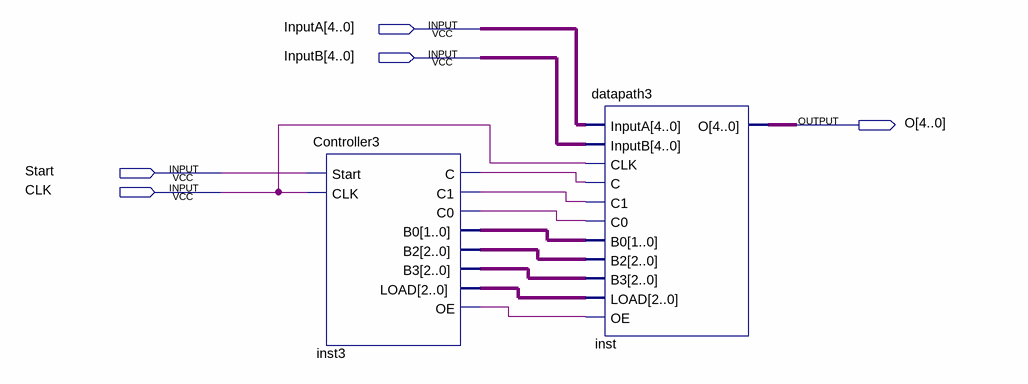
[diagram p0: schematic sheet]
// Quartus schematic BS.bdf as structural Verilog: 2 symbols, 5 pins
module BS (
  input  [4:0] InputA,
  input  [4:0] InputB,
  input  Start,
  input  CLK,
  output [4:0] O
);

  wire inst3_c, inst3_c0, inst3_c1, inst3_oe;
  wire [1:0] inst3_b0;
  wire [2:0] inst3_b2, inst3_b3, inst3_load;

  Controller3 inst3 (
    .Start(Start), .CLK(CLK), .C(inst3_c), .C1(inst3_c1), .C0(inst3_c0), .B0(inst3_b0), .B2(inst3_b2),
    .B3(inst3_b3), .LOAD(inst3_load), .OE(inst3_oe));
  datapath3 inst (
    .InputA(InputA), .InputB(InputB), .CLK(CLK), .C(inst3_c), .C1(inst3_c1), .C0(inst3_c0), .B0(inst3_b0),
    .B2(inst3_b2), .B3(inst3_b3), .LOAD(inst3_load), .OE(inst3_oe), .O(O));
endmodule
